# EAGLE schematic Fabulaser (EAGLE 9.6.2)
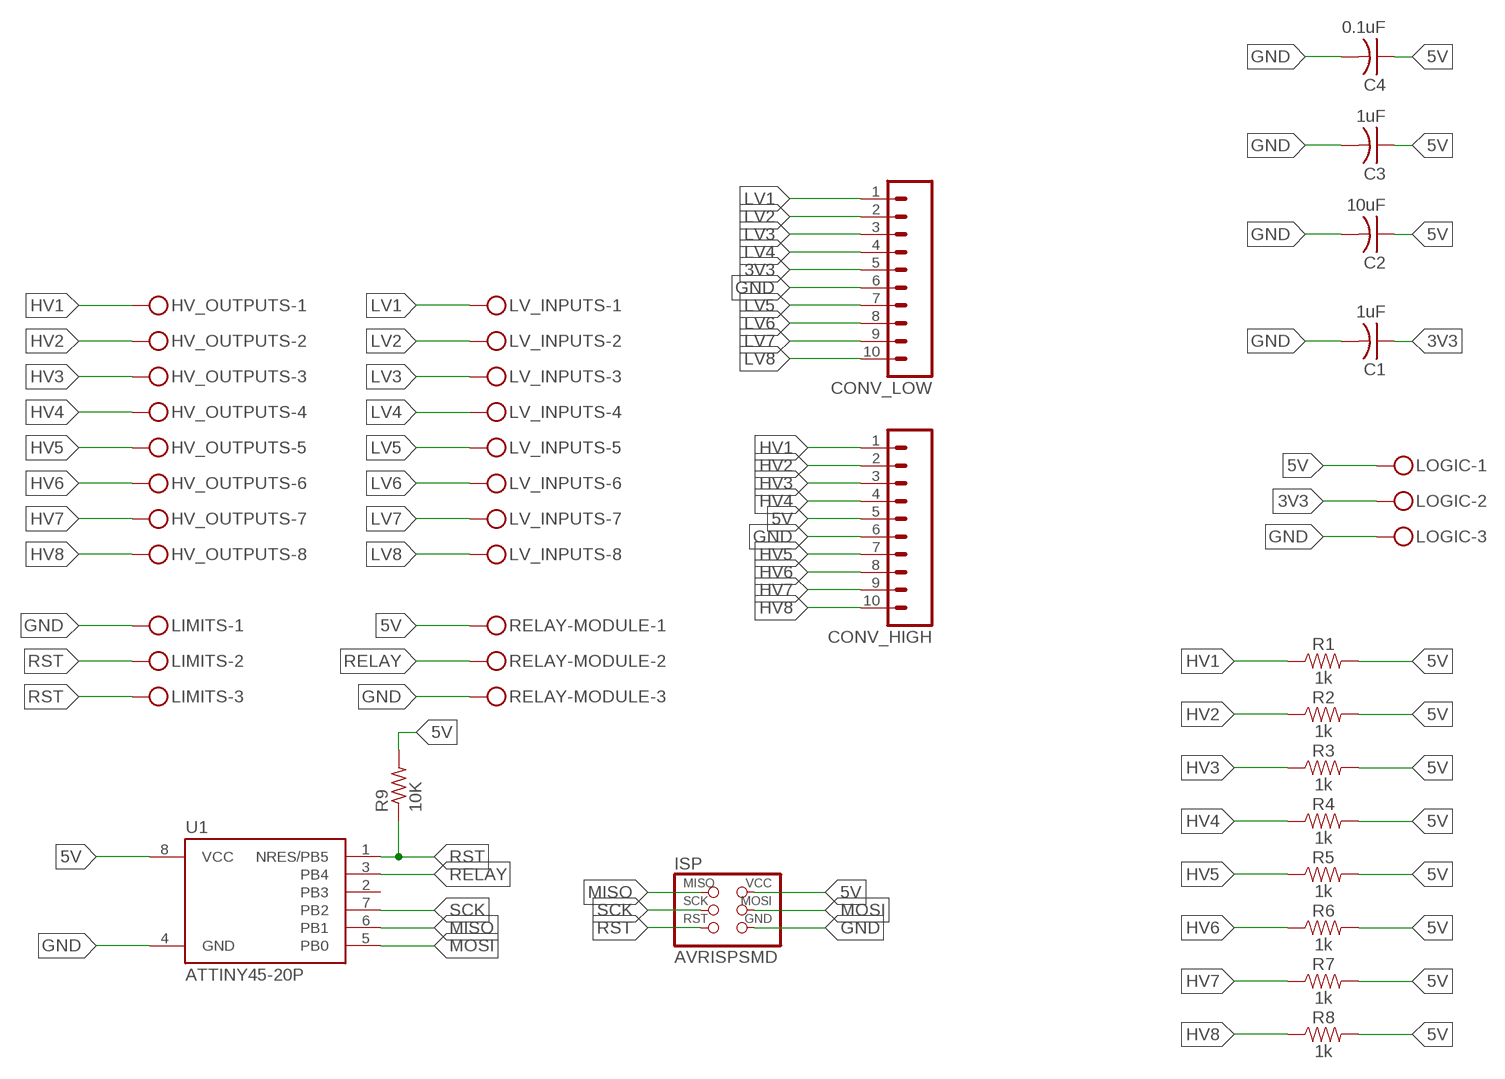
[diagram p0: schematic, sheet 1]

## Parts
C1  1uF  CAP-US1206FAB  [C1206FAB]
C2  10uF  CAP-US1206FAB  [C1206FAB]
C3  1uF  CAP-US1206FAB  [C1206FAB]
C4  0.1uF  CAP-US1206FAB  [C1206FAB]
CONV_HIGH  M10  [10P]
CONV_LOW  M10  [10P]
HV_OUTPUTS  MKDSN1,5/8-5,08  [MKDSN1,5/8-5,08]
ISP  AVRISPSMD  [2X03SMD]
LIMITS  MKDSN1,5/3-5,08  [MKDSN1,5/3-5,08]
LOGIC  MKDSN1,5/3-5,08  [MKDSN1,5/3-5,08]
LV_INPUTS  MKDSN1,5/8-5,08  [MKDSN1,5/8-5,08]
R1  1k  1KOHM-HORIZ-1/4W-5%  [AXIAL-0.3]
R2  1k  1KOHM-HORIZ-1/4W-5%  [AXIAL-0.3]
R3  1k  1KOHM-HORIZ-1/4W-5%  [AXIAL-0.3]
R4  1k  1KOHM-HORIZ-1/4W-5%  [AXIAL-0.3]
R5  1k  1KOHM-HORIZ-1/4W-5%  [AXIAL-0.3]
R6  1k  1KOHM-HORIZ-1/4W-5%  [AXIAL-0.3]
R7  1k  1KOHM-HORIZ-1/4W-5%  [AXIAL-0.3]
R8  1k  1KOHM-HORIZ-1/4W-1%  [AXIAL-0.3]
R9  10K  RES-US1206FAB  [R1206FAB]
RELAY-MODULE  MKDSN1,5/3-5,08  [MKDSN1,5/3-5,08]
U1  ATTINY45-20P  [PDIP08_300MIL]

## Nets
3V3: C1.1 CONV_LOW.5 LOGIC.2
5V: C2.1 C3.1 C4.1 CONV_HIGH.5 ISP.2(VCC) LOGIC.1 R1.P$2 R2.P$2 R3.P$2 R4.P$2 R5.P$2 R6.P$2 R7.P$2 R8.P$2 R9.2 RELAY-MODULE.1 U1.8(VCC)
GND: C1.2 C2.2 C3.2 C4.2 CONV_HIGH.6 CONV_LOW.6 ISP.6(GND) LIMITS.1 LOGIC.3 RELAY-MODULE.3 U1.4(GND)
HV1: CONV_HIGH.1 HV_OUTPUTS.1 R1.P$1
HV2: CONV_HIGH.2 HV_OUTPUTS.2 R2.P$1
HV3: CONV_HIGH.3 HV_OUTPUTS.3 R3.P$1
HV4: CONV_HIGH.4 HV_OUTPUTS.4 R4.P$1
HV5: CONV_HIGH.7 HV_OUTPUTS.5 R5.P$1
HV6: CONV_HIGH.8 HV_OUTPUTS.6 R6.P$1
HV7: CONV_HIGH.9 HV_OUTPUTS.7 R7.P$1
HV8: CONV_HIGH.10 HV_OUTPUTS.8 R8.P$1
LV1: CONV_LOW.1 LV_INPUTS.1
LV2: CONV_LOW.2 LV_INPUTS.2
LV3: CONV_LOW.3 LV_INPUTS.3
LV4: CONV_LOW.4 LV_INPUTS.4
LV5: CONV_LOW.7 LV_INPUTS.5
LV6: CONV_LOW.8 LV_INPUTS.6
LV7: CONV_LOW.9 LV_INPUTS.7
LV8: CONV_LOW.10 LV_INPUTS.8
MISO: ISP.1(MISO) U1.6(PB1)
MOSI: ISP.4(MOSI) U1.5(PB0)
RELAY: RELAY-MODULE.2 U1.3(PB4)
RST: ISP.5(RST) LIMITS.2 LIMITS.3 R9.1 U1.1(NRES/PB5)
SCK: ISP.3(SCK) U1.7(PB2)
Unconnected: U1.2(PB3)

## Library data of the parts
C1-C4 = fab:CAP-US
CONV_HIGH CONV_LOW = con-amp-quick:M10: AMP QUICK CONNECTOR; OC_FARNELL: unknown; OC_NEWARK: unknown
HV_OUTPUTS LV_INPUTS = con-phoenix-508:MKDSN1,5/8-5,08: MKDSN 1,5/ 8-5,08 Printklemme Nennstrom: 13,5 A Nennspannung: 250 V Rastermaß: 5,08 mm Polzahl: 8 Anschlussart: Schraubanschluss Montage: Löten Anschlussrichtung Leiter/Platine: 0 ° Artikelnummer: 1729186 Source: http://eshop.phoenixcontact.com .. 1729186.pdf
ISP = fab:AVRISP; SPICEPREFIX: X
LIMITS LOGIC RELAY-MODULE = con-phoenix-508:MKDSN1,5/3-5,08: MKDSN 1,5/ 3-5,08 Printklemme Nennstrom: 13,5 A Nennspannung: 250 V Rastermaß: 5,08 mm Polzahl: 3 Anschlussart: Schraubanschluss Montage: Löten Anschlussrichtung Leiter/Platine: 0 ° Artikelnummer: 1729131 Source: http://eshop.phoenixcontact.com .. 1729131.pdf
R1-R7 = SparkFun-Resistors:1KOHM: 1kΩ resistor A resistor is a passive two-terminal electrical component that implements electrical resistance as a circuit element. Resistors act to reduce current flow, and, at the same time, act to lower voltage levels within circuits. - Wikipedia; PROD_ID: RES-08380
R8 = SparkFun-Resistors:1KOHM: 1kΩ resistor A resistor is a passive two-terminal electrical component that implements electrical resistance as a circuit element. Resistors act to reduce current flow, and, at the same time, act to lower voltage levels within circuits. - Wikipedia; PROD_ID: RES-12182
R9 = fab:RES-US: Resistor (US Symbol) Variants with postfix FAB are widened to allow the routing of internal traces
U1 = _hhn_attiny25_45_85:ATTINY45*: ATMEL ATtiny 45 Packages: P = PDIP 08 30mil S = SOIC 08 EIAJ 208mil X = TSSOP 08 4.4mm Technologies Note: for complete ordering code (temp. range, finish, tape&reel etc.) see www.atmel.com • Supply Voltage: V = (1.8…5.5)V | [blank] = (2.7…5.5)V • Speed: 10 = 10 MHz | 20 = 20 MHz Author: Dipl.-Ing. FH Rainer Bayer HHN Hochschule Heilbronn (Heilbronn University), rainer.bayer@hs-heilbronn.de Ingenieurbüro ing-rb, mail@ing-rb.de